# Altium schematic sheet MICROCONTROLLER_RADIO.SchDoc: Microcontroller and radio
size B; DrawnBy: Kwinten Schram; SheetNumber: 2; SheetTotal: 3
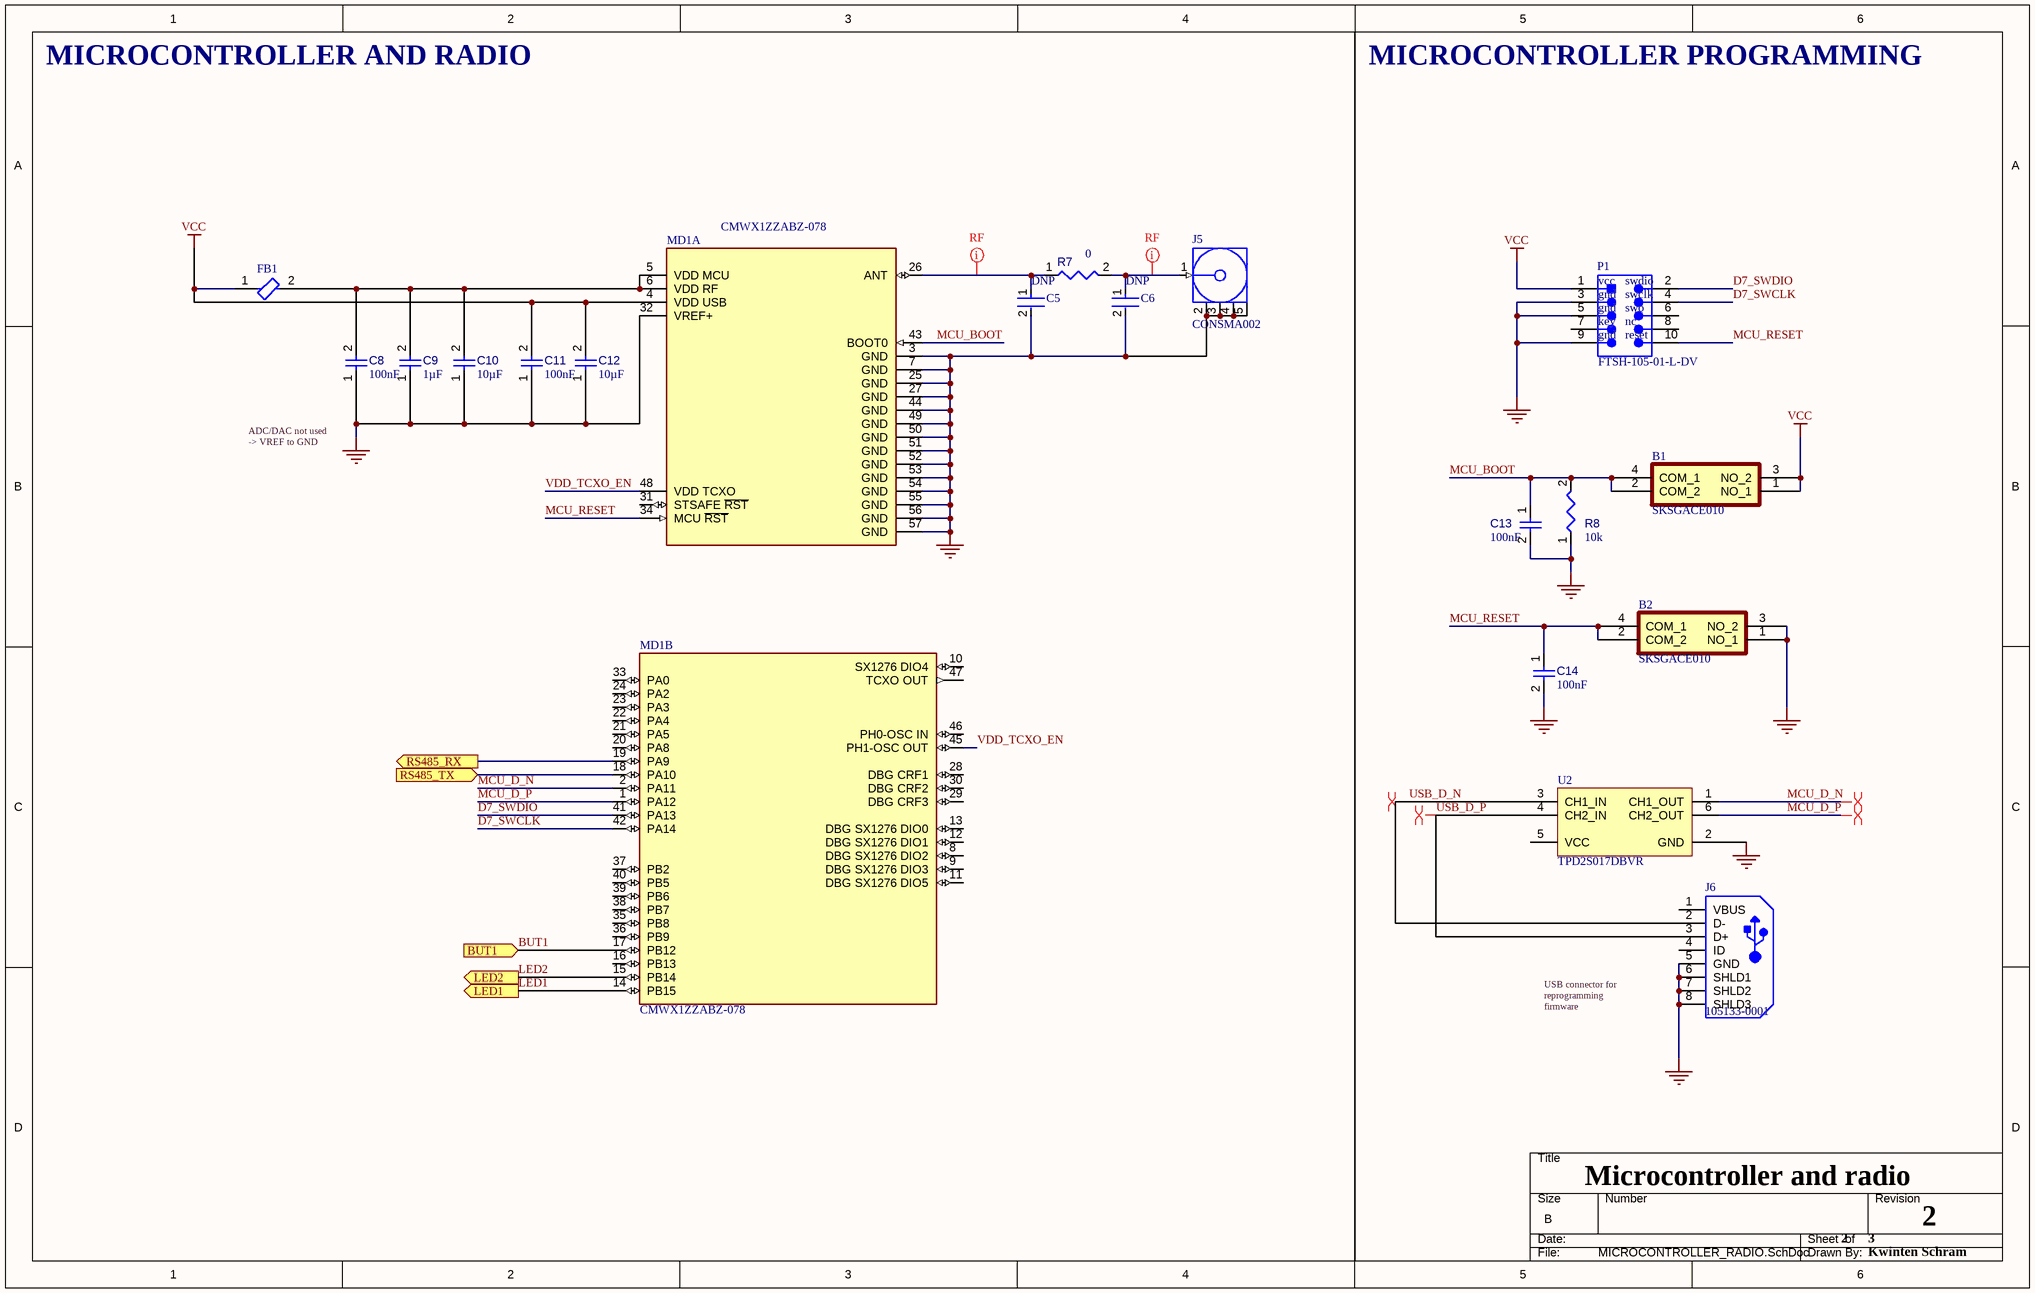
[diagram p0: MICROCONTROLLER_RADIO.SchDoc]

## Parts
B1  SKSGACE010  [RKC2SJF170SMTRLFS-Footprint-1]
B2  SKSGACE010  [RKC2SJF170SMTRLFS-Footprint-1]
C5  Capacitance: DNP  [FP-CC0402-IPC_A]  (hidden comment: CC0402KRX7R7BB104)
C6  Capacitance: DNP  [FP-CC0402-IPC_A]  (hidden comment: CC0402KRX7R7BB104)
C8  value 100nF  [FP-0603-L_1_6_0_15-W_0_81-MFG]  (hidden comment: 06033C104KAT2A)
C9  value 1µF  [FP-CC0603-DA-MFG]  (hidden comment: CC0603KPX7R8BB105)
C10  value 10µF  [FP-GRM188-0_1-e0_2_0_55-MFG]  (hidden comment: GRM188R60J106ME47D)
C11  value 100nF  [FP-0603-L_1_6_0_15-W_0_81-MFG]  (hidden comment: 06033C104KAT2A)
C12  value 10µF  [FP-GRM188-0_1-e0_2_0_55-MFG]  (hidden comment: GRM188R60J106ME47D)
C13  value 100nF  [FP-0603-L_1_6_0_15-W_0_81-MFG]  (hidden comment: 06033C104KAT2A)
C14  value 100nF  [FP-0603-L_1_6_0_15-W_0_81-MFG]  (hidden comment: 06033C104KAT2A)
FB1  BLM18AG121SN1D  [FP-BLM18-0_15-t0_8-IPC_B]  (value not drawn)
J5  CONSMA002  [CON-REVSMA-RA]
J6  105133-0001  [MOLX-105133-0001_V]
MD1  CMWX1ZZABZ-078  [FP-CMWX1ZZABZ-078-MFG]  (parts A,B of 2)
P1  FTSH-105-01-L-DV  [SMTC-FTSH-105-01-L-DV_V]
R7  value 0  [FP-CRCW0402-e3-IPC_A]  (hidden comment: CRCW04020000Z0ED)
R8  value 10k  [RESC1005X40X25NL05T10]  (hidden comment: RC0402FR-0710KL)
U2  TPD2S017DBVR  [DBV0006A_N]

## Ports
BUT1 (in), LED1 (out), LED2 (out), RS485_RX (out), RS485_TX (in)

## Nets
GND: B2.1(NO_1) B2.3(NO_2) C5.2 C6.2 C8.1 C9.1 C10.1 C11.1 C12.1 C13.2 C14.2 J5.2(GND) J5.3(GND) J5.4(GND) J5.5(GND) J6.5(GND) J6.6(SHLD1) J6.7(SHLD2) J6.8(SHLD3) MD1.3(GND) MD1.7(GND) MD1.25(GND) MD1.27(GND) MD1.32(VREF+) MD1.44(GND) MD1.49(GND) MD1.50(GND) MD1.51(GND) MD1.52(GND) MD1.53(GND) MD1.54(GND) MD1.55(GND) MD1.56(GND) MD1.57(GND) P1.3 P1.5 P1.9 R8.1 U2.2(GND)
VCC: B1.1(NO_1) B1.3(NO_2) C11.2 C12.2 FB1.1 MD1.4(VDD_USB) P1.1
BUT1: MD1.17(PB12) ; port BUT1
D7_SWCLK: MD1.42(PA14) P1.4
D7_SWDIO: MD1.41(PA13) P1.2
LED1: MD1.14(PB15) ; port LED1
LED2: MD1.15(PB14) ; port LED2
MCU_BOOT: B1.2(COM_2) B1.4(COM_1) C13.1 MD1.43(BOOT0) R8.2
MCU_D_N: MD1.2(PA11) U2.1(CH1_OUT)
MCU_D_P: MD1.1(PA12) U2.6(CH2_OUT)
MCU_RESET: B2.2(COM_2) B2.4(COM_1) C14.1 MD1.34(MCU_~{RST}) P1.10
RS485_RX: MD1.19(PA9) ; port RS485_RX
RS485_TX: MD1.18(PA10) ; port RS485_TX
USB_D_N: J6.2(D-) U2.3(CH1_IN)
USB_D_P: J6.3(D+) U2.4(CH2_IN)
VDD_TCXO_EN: MD1.45(PH1-OSC_OUT) MD1.48(VDD_TCXO)
NetC5_1: C5.1 MD1.26(ANT) R7.1
NetC6_1: C6.1 J5.1(Signal) R7.2
NetC8_2: C8.2 C9.2 C10.2 FB1.2 MD1.5(VDD_MCU) MD1.6(VDD_RF)

Not connected (* = marked no-connect by the designer): J6 1(VBUS) 4(ID); MD1 8(DBG_SX1276_DIO2) 9(DBG_SX1276_DIO3) 10(SX1276_DIO4) 11(DBG_SX1276_DIO5) 12(DBG_SX1276_DIO1) 13(DBG_SX1276_DIO0) 16(PB13) 20(PA8) 21(PA5) 22(PA4) 23(PA3) 24(PA2) 28(DBG_CRF1) 29(DBG_CRF3) 30(DBG_CRF2) 31(STSAFE_~{RST}) 33(PA0) 35(PB8) 36(PB9) 37(PB2) 38(PB7) 39(PB6) 40(PB5) 46(PH0-OSC_IN) 47(TCXO_OUT); P1 6 7 8; U2 5(VCC)

## Layout directives
net class RF: NetC5_1, NetC6_1
differential pair; net class USB: MCU_D_N, MCU_D_P, USB_D_N, USB_D_P

## Notes on the sheet
- MICROCONTROLLER AND RADIO
- MICROCONTROLLER PROGRAMMING
- (near P1) vcc
- (near P1) gnd
- (near P1) swclk
- (near P1) swdio
- (near P1) key
- (near P1) reset
- (near P1) nc
- (near P1) swo
- ADC/DAC not used -> VREF to GND
- USB connector for reprogramming firmware
- 2
- DWG. NO.
- REV.
- SHT.
- THIS DOCUMENT AND THE DATA DISCLOSED HEREIN OR HEREWITH IS THE PROPERTY OF ALTIUM LIMITED AND MAY BE FREELY DISTRIBUTED IN WHOLE. NO RIGHTS ARE RESERVED OR EXPRESS OR IMPLIED WARANTEE GIVEN.
- REVISION
- DESCRIPTION
- DATE
- APPROVED
- ENG:
- APPROVALS
- PROJECT
- DSN:
- CHK:
- REFERENCE DOCUMENTS
- PROJECT REVISION:
- TITLE
- DOCUMENT REVISION:
- DESIGN ITEM:
- BOM:
- FAB DWG:
- PCB DWG:
- ASSY DWG:
- SCALE:
- SIZE
- B
- CAGE CODE
- FILE NAME
- DWG NO.
- SHEET
- OF
- REV

## Library data of the parts
B1 B2 = CMP-011-00021-2: Keypad Switch, 1 Switches, SPST, Momentary-tactile, 0.05A, 12VDC, 1.6N, Solder Terminal, Surface Mount-straight; Contact Current(DC)-Max: 50mA; Body Length or Diameter: 3.5mm; Contact DC Max Rating R Load: .05A@12VDC; Body Height: 1mm; Circuit Configuration: 1X1; Actuator Type: STEM; Contact Voltage(DC)-Max: 12V; Number of Switches: 1; Body Breadth: 2.7inch; Mounting Technology: Surface Mount; Max Operating Temperature: 85°C; Min Operating Temperature: -30°C; RoHS Compliant: Yes; Packaging: Tape and Reel; Switch Type: Keypad; Switch Function: SPST; Termination: Solder; Switch Action: MOMENTARY-TACTILE; Operating Force-Max: 1.6N
C5 C6 = CMP-03422-000048-1: CAP CER 0.1UF 16V X7R 0402; Manufacturer: YAGEO; Material: Ceramic; Automotive Grade: NA; Temperature Coefficient: 30ppm/°C; Tolerance: 0.1; Value: 100 nF; Device Class L1: Passive Components; Temperature Range Low: -55°C; Device Class L3: Ceramic Capacitors; Temperature Characteristic: X7R; Ipc Land Pattern Name: CAPC10050X50; Temperature Range High: +125°C; Voltage Rating: 16 V; Temperature: -55°C to +125°C; RoHS: TRUE; Automotive: No; Height: 0.55mm; Device Class L2: Capacitors; Digikey Description: CAP CER 0.1UF 16V X7R 0402; Package: CC0402; Footprint Url: http://www.yageo.com/exep/pages/download/literatures/UPY-C_GEN_24.pdf; ComponentLink2Description: Datasheet; Category: Cap; Lead Free: Yes; Octopart: https://octopart.com/cc0402krx7r7bb104-yageo-42244624; ComponentLink2URL: http://www.yageo.com/documents/recent/UPY-GP_NP0_16V-to-50V_16.pdf; Manufacturer Part Number: CC0402KRX7R7BB104; Mouser Description: 0402 0.1 uF 16 V ±10 % Tolerance X7R SMT Multilayer Ceramic Capacitor
C8 C11 C13 C14 = CMP-001-00020-3: Ceramic Capacitor, Multilayer, Ceramic, 25V, 10% +Tol, 10% -Tol, X7R, 15% TC, 0.1uF, Surface Mount, 0603; Multilayer: Yes; Reach SVHC Compliant: Yes; Height: 0.9mm; Package Shape: Rectangular; Max Operating Temperature: 125°C; Rated DC Voltage (URdc): 25V; Min Operating Temperature: -55°C; Dielectric Material: Ceramic; Capacitor Type: Ceramic; Case/Package: 0603; Pins: 2; JESD-609 Code: e3; Tolerance: 10%; Package Style: SMTMeter; Termination: Wraparound; RoHS Compliant: Yes; Length: 1.6mm; Temperature Characteristics Code: X7R; Tolerance (fill in as +-): 10%; Tolerance  (fill in as +-): 10%; Packaging: Tape and Reel; Mounting Technology: Surface Mount; Width: 0.81mm; Terminal Finish: Nickel
C9 = CMP-001-00009-4: Ceramic Capacitor, Multilayer, Ceramic, 25V, 10% +Tol, 10% -Tol, X7R, 15% TC, 1uF, Surface Mount, 0603; Multilayer: Yes; Dielectric Material: Ceramic; Min Operating Temperature: -55°C; Pins: 2; Case/Package: 0603; Capacitance: 1uF; Packaging: Tape and Reel; REACH SVHC: Yes; Rated DC Voltage (URdc): 25V; Width: 0.8mm; RoHS Compliant: Yes; Voltage Rating: 25V; Tolerance: 10%; Size Code: 0603; Terminal Finish: Nickel; Max Operating Temperature: 125°C; JESD-609 Code: e3; Negative Tolerance: 10%; Temperature Characteristics Code: X7R; Package Style: SMTMeter; Length: 1.6mm; Number of Pins: 2; Capacitor Type: Ceramic; Positive Tolerance: 10%; Height: 0.8mm
C10 C12 = CMP-001-00036-1: Ceramic Capacitor, Multilayer, Ceramic, 6.3V, 20% +Tol, 20% -Tol, X5R, 15% TC, 10uF, Surface Mount, 0603; Multilayer: Yes; Package Style: SMTMeter; Mounting Technology: Surface Mount; Terminal Finish: Nickel; Tolerance  (fill in as +-): 20%; JESD-609 Code: e3; Tolerance (fill in as +-): 20%; Pins: 2; Package Shape: Rectangular; Termination: Wraparound; Length: 1.6mm; Rated DC Voltage (URdc): 6.3V; Max Operating Temperature: 85°C; Case/Package: 0603; Width: 0.8mm; Reach SVHC Compliant: Yes; Dielectric Material: Ceramic; RoHS Compliant: Yes; Temperature Characteristics Code: X5R; Min Operating Temperature: -55°C; Height: 0.8mm; Capacitor Type: Ceramic; Packaging: Tape and Reel; Tolerance: 20%
FB1 = CMP-0686-00439-3: Chip Ferrite Bead, 0603, 120Ω @ 100MHz, 0.18Ω, 25%, 800mA; DC Resistance (DCR): 180mR; Number of Lines: 1; Current Rating: 500mA; Material: Steel; Impedance: 120R; Shielding: Unshielded; Case/Package: 0603; Max Operating Temperature: 125°C; Min Operating Temperature: -55°C; Series: BLM18A; Case Code (Metric): 1608; DC Resistance-Max: 180mR; Package Quantity: 1; Core Material: Ferrite; Radiation Hardening: No; Length: 1.6mm; Lead Free: Lead Free; Max DC Current: 500mA; Termination: SMD/SMT; Number of Pins: 2; Tolerance: 25%; Military Standard: Not; REACH SVHC: No SVHC; Number of Circuits: 1; Test Frequency: 100MHz; Max Current Rating: 500mA; Depth: 0.8mm; Frequency: 100MHz; Width: 0.8mm; Case Code (Imperial): 0603; DC Current: 500mA; Height: 0.8mm; RoHS Compliant: Yes; Packaging: Tape and Reel
J5 = CMP-002-00010-2: RF SMA Connector; Panel Mount: No; Option: General Purpose; DIN Conformance: No; Characteristic Impedance: 50R; Coupling Type: Threaded; Contact Finish - Termination: GOLD; RoHS Compliant: Yes; Contact Gender: Female; Filter Feature: No; IEC Conformance: No; Contact Finish - Mating: GOLD; Reach SVHC Compliant: Yes; Termination: Solder; Contact Material: Brass; JESD-609 Code: e4; Connector Type: SMA; MIL Conformance: No; Insulation Material: POLYTETRAFLUORO; Mounting Style: RIGHT ANGLE; Mounting Technology: Board
J6 = CMP-002-00034-1: USB Connector, 5 Contact(s), Female, Right Angle, Surface Mount Terminal, Locking, Receptacle; Manufacturer Series: 105133; Durability: 10000Cycles; Insulation Resistance: 1GR; Board Mounting Option: PEG; Contact Resistance: 30mR; Reference Standard: UL; PCB Contact Pattern: RECTANGULAR; Number Of Connectors: 1; Reliability: COMMERCIAL; Dielectric Withstanding Voltage (AC): 140V; Number of Contacts: 5; Connector Type: TELECOM AND DATACOM CONNECTOR; Insertion Force-Max: 35.00576N; Withdrawl Force-Min: 8.0064N; Shell Material: Stainless Steel; Max Operating Temperature: 85°C; Shell Finish: Tin; RoHS Compliant: Yes; Contact Finish - Termination: GOLD; Body/Shell Style: RECEPTACLE; Contact Style: USB; Termination: SMD/SMT; Contact Finish - Mating: GOLD; Mounting Style: RIGHT ANGLE; Number Of PCB Rows: 1; Mounting Technology: Board; Min Operating Temperature: -30°C; Terminal Pitch: 0.6604mm; Contact Gender: Female; JESD-609 Code: e4; Mounting Option 1: LOCKING; Contact Material: Copper Alloy; Insulation Material: Thermoplastic; Reach SVHC Compliant: Yes
MD1 = CMP-020-00001-6: Support Circuit, 1-Trnsvr; Capacitance: 4,8µF; Inductance: 0,121µH
P1 = CMP-2000-05354-1: Male Header, Pitch 1.27 mm, 2 x 5 Position, Height 5.96 mm, -55 to 125 degC, RoHS, Bulk; Manufacturer: Samtec; Connector Type: Header,Unshrouded; Pitch: 0.050"(1.27mm); Mating Products: FLE-105-01-G-DV-TR-ND-CONNSKT1.27MM10POSDUALSMDCLP-105-02-G-D-P-TR-ND-CONNRCPT10POSDUAL.05"SMDSFMC-105-L2-S-D-TR-ND-CONN.05"SURFACE10POSSMTSFMH-105-02-L-D-TR-ND-CONNRECEPT10POS.50"SMTFLE-105-01-G-DV-A-ND-CONNSKT1.27MM10POSDUALSMDCLP-105-02-G-D-BE-ND-CONNRCPT10POSDUAL.05"SMDFLE-105-01-G-DV-A-P-ND-CONNSKT1.27MM10POSDUALSMDSAM1153-05-ND-CONNRCPT10POSDUAL.05"SMDSAM1155-05-ND-CONNRCPT10POSDUAL.05"SMDSAM1154-05-ND-CONNRCPT10POSDUAL.05"SMDSFMH-105-02-L-D-LC-ND-CONNRECEPT10POS.50"SMTSAM1226-05-ND-CONNRCPT.05"10POSDUALSMD; Catalog Drawings: FTSHSeriesFTSHSeriesSMTSide; Other Names: SAM1161-05; EDA / CAD Models: DownloadfromAcceleratedDesigns; Number of Positions Loaded: All; Number of Positions: 10; Featured Product: Board-To-BoardInterconnectSystems; Online Catalog: FTSHSeries; Product Training Modules: Board-to-BoardConnectors; Category: Connectors,Interconnects; Number of Rows: 2; Contact Finish: Gold; Termination: Solder; Mounting Type: SurfaceMount; Series: FTSH; Contact Mating Length: 0.120"(3.05mm); Row Spacing: 0.050"(1.27mm); Datasheet URL: https://datasheet.ciiva.com/30493/0900766b80adfe36-30493006.pdf; Contact Finish Thickness: 10µin(0.25µm); Features: -; Standard Package: 1; Packaging: Bulk; Datasheet Version: Feb-08; Manufacturer URL: http://www.samtec.com/; Fastening Type: -; Family: RectangularConnectors-Headers,MalePins; Contact Type: MalePin; Color: Black
R7 = CMP-009-00087-1: Metal Glaze/thick Film, 0.063W, 0ohm, Surface Mount, 0402; Power: 63mW; Rated Temperature: 70°C; Package Length: 1mm; Package Width: 0.5mm; Reference Standard: AEC-Q200; Package Height: 0.35mm; Termination: Wraparound; Min Operating Temperature: -55°C; Packaging: Tape and Reel; Max Operating Temperature: 155°C; Technology: METAL GLAZE/THICK FILM; Case/Package: 0402; JESD-609 Code: e3; Pins: 2; Resistor Type: FIXED RESISTOR; Mounting Technology: Surface Mount; Terminal Finish: Nickel; RoHS Compliant: Yes; Package Shape: Rectangular; Reach SVHC Compliant: Yes; Package Style: SMTMeter; Construction: Chip
R8 = CMP-009-00003-2: Fixed Resistor, Metal Glaze/thick Film, 0.0625W, 10000ohm, 50V, 1% +/-Tol, 100ppm/Cel, Surface Mount, 0402; Additional Feature: LASER TRIMMABLE; Package Height: 0.35mm; Package Width: 0.5mm; Temperature Coefficient: 100ppm/°C; Rated Temperature: 70°C; Package Length: 1mm; Resistance: 10kR; Power: 62.5mW; REACH SVHC: Yes; Terminal Finish: Nickel; Working Voltage: 50V; Max Operating Temperature: 155°C; Number of Pins: 2; Tolerance: 1%; Packaging: Tape and Reel; Voltage Rating: 50V; Package Style: SMTMeter; Resistor Type: FIXED RESISTOR; Package Shape: Rectangular; Mounting Technology: Surface Mount; RoHS Compliant: Yes; Case/Package: 0402; Construction: Chip; JESD-609 Code: e3; Pins: 2; Rated Power Dissipation (P): 62.5mW; Mount: Surface Mount; Termination: Wraparound; Technology: METAL GLAZE/THICK FILM; Size Code: 0402; Min Operating Temperature: -55°C
U2 = CMP-004-00019-1: Trans Voltage Suppressor Diode, 5V V(RWM), Unidirectional, 4 Element, Silicon; Number of Elements: 4; Breakdown Voltage-Nom: 12V; Max Power Dissipation: 463mW; Min Breakdown Voltage: 11V; Package Body Material: Plastic; Qualification Status: Not Qualified; Moisture Sensitivity Level: 1; JESD-609 Code: e3; JESD-30 Code: R-PDSO-G6; Surface Mount: Yes; Forward Voltage: 5V; Technology: AVALANCHE; Diode Element Material: SILICON; Terminal Form: Gull Wing; Polarity: Unidirectional; RoHS Compliant: Yes; Peak Reflow Temperature (Cel): 260°C; Terminal Position: DUAL; Diode Type: TRANS VOLTAGE SUPPRESSOR; Terminal Finish: Tin; Pins: 6; Reach SVHC Compliant: Yes; Package Shape: Rectangular; Package Style: SMALL OUTLINEMeter